# Altium schematic sheet microcontroller module.SchDoc: Microcontroller Module (MCM)
size A4; Date: 2014-12-21; Author: Artur Scholz; DocumentNumber: LibreCube LC23-01a
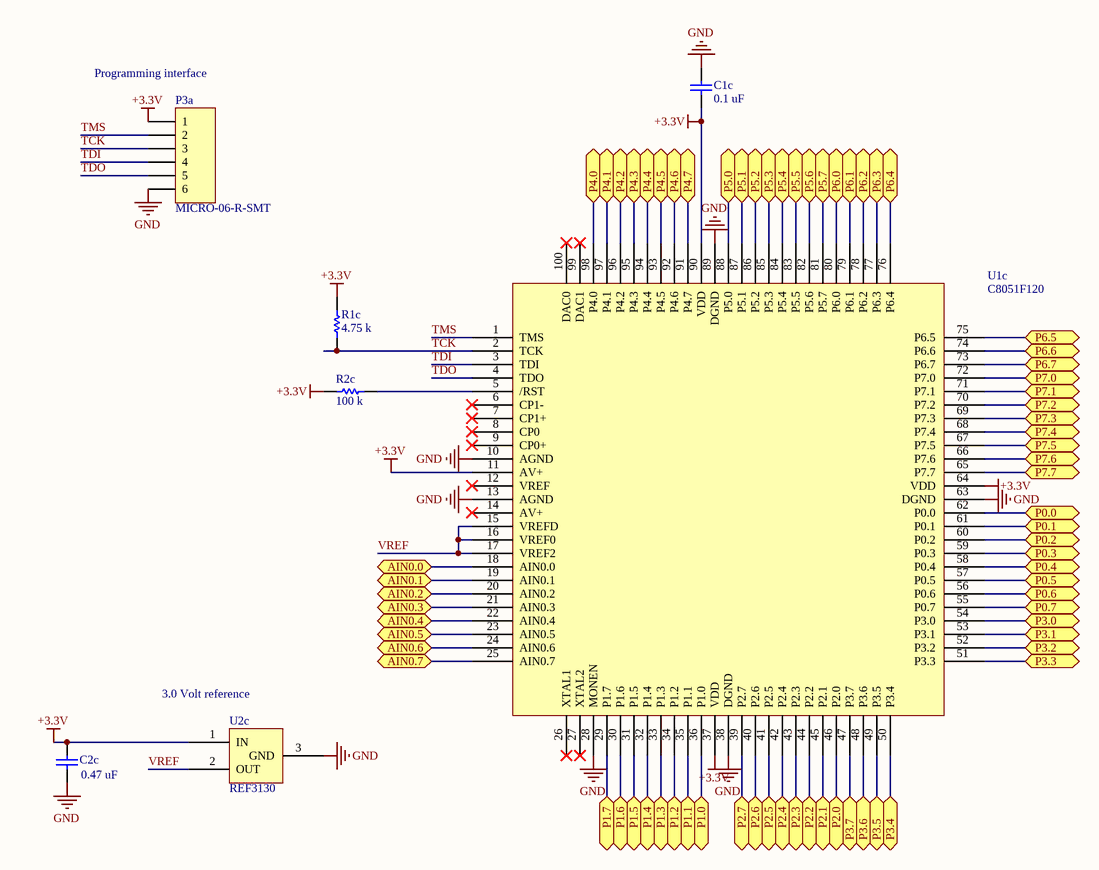
[diagram p0: microcontroller module.SchDoc]

## Parts
C1c  0.1 uF  [0603]
C2c  0.47 uF  [0603]
P3a  MICRO-06-R-SMT  [MICRO-06-R-SMT]
R1c  4.75 k  [0603]
R2c  100 k  [0603]
U1c  C8051F120  [TQFP-100]
U2c  REF3130  [SOT23-3]

## Ports
AIN0.0, AIN0.1, AIN0.2, AIN0.3, AIN0.4, AIN0.5, AIN0.6, AIN0.7, P0.0, P0.1, P0.2, P0.3, P0.4, P0.5, P0.6, P0.7, P1.0, P1.1, P1.2, P1.3, P1.4, P1.5, P1.6, P1.7, P2.0, P2.1, P2.2, P2.3, P2.4, P2.5, P2.6, P2.7, P3.0, P3.1, P3.2, P3.3, P3.4, P3.5, P3.6, P3.7, P4.0, P4.1, P4.2, P4.3, P4.4, P4.5, P4.6, P4.7, P5.0, P5.1, P5.2, P5.3, P5.4, P5.5, P5.6, P5.7, P6.0, P6.1, P6.2, P6.3, P6.4, P6.5, P6.6, P6.7, P7.0, P7.1, P7.2, P7.3, P7.4, P7.5, P7.6, P7.7

## Nets
+3.3V: C1c.2 C2c.1 P3a.1 R1c.2 R2c.2 U1c.11(AV+) U1c.37(VDD) U1c.64(VDD) U1c.90(VDD) U2c.1(IN)
GND: C1c.1 C2c.2 P3a.6 U1c.10(AGND) U1c.13(AGND) U1c.28(MONEN) U1c.38(DGND) U1c.63(DGND) U1c.89(DGND) U2c.3(GND)
AIN0.0: U1c.18(AIN0.0) ; port AIN0.0
AIN0.1: U1c.19(AIN0.1) ; port AIN0.1
AIN0.2: U1c.20(AIN0.2) ; port AIN0.2
AIN0.3: U1c.21(AIN0.3) ; port AIN0.3
AIN0.4: U1c.22(AIN0.4) ; port AIN0.4
AIN0.5: U1c.23(AIN0.5) ; port AIN0.5
AIN0.6: U1c.24(AIN0.6) ; port AIN0.6
AIN0.7: U1c.25(AIN0.7) ; port AIN0.7
P0.0: U1c.62(P0.0) ; port P0.0
P0.1: U1c.61(P0.1) ; port P0.1
P0.2: U1c.60(P0.2) ; port P0.2
P0.3: U1c.59(P0.3) ; port P0.3
P0.4: U1c.58(P0.4) ; port P0.4
P0.5: U1c.57(P0.5) ; port P0.5
P0.6: U1c.56(P0.6) ; port P0.6
P0.7: U1c.55(P0.7) ; port P0.7
P1.0: U1c.36(P1.0) ; port P1.0
P1.1: U1c.35(P1.1) ; port P1.1
P1.2: U1c.34(P1.2) ; port P1.2
P1.3: U1c.33(P1.3) ; port P1.3
P1.4: U1c.32(P1.4) ; port P1.4
P1.5: U1c.31(P1.5) ; port P1.5
P1.6: U1c.30(P1.6) ; port P1.6
P1.7: U1c.29(P1.7) ; port P1.7
P2.0: U1c.46(P2.0) ; port P2.0
P2.1: U1c.45(P2.1) ; port P2.1
P2.2: U1c.44(P2.2) ; port P2.2
P2.3: U1c.43(P2.3) ; port P2.3
P2.4: U1c.42(P2.4) ; port P2.4
P2.5: U1c.41(P2.5) ; port P2.5
P2.6: U1c.40(P2.6) ; port P2.6
P2.7: U1c.39(P2.7) ; port P2.7
P3.0: U1c.54(P3.0) ; port P3.0
P3.1: U1c.53(P3.1) ; port P3.1
P3.2: U1c.52(P3.2) ; port P3.2
P3.3: U1c.51(P3.3) ; port P3.3
P3.4: U1c.50(P3.4) ; port P3.4
P3.5: U1c.49(P3.5) ; port P3.5
P3.6: U1c.48(P3.6) ; port P3.6
P3.7: U1c.47(P3.7) ; port P3.7
P4.0: U1c.98(P4.0) ; port P4.0
P4.1: U1c.97(P4.1) ; port P4.1
P4.2: U1c.96(P4.2) ; port P4.2
P4.3: U1c.95(P4.3) ; port P4.3
P4.4: U1c.94(P4.4) ; port P4.4
P4.5: U1c.93(P4.5) ; port P4.5
P4.6: U1c.92(P4.6) ; port P4.6
P4.7: U1c.91(P4.7) ; port P4.7
P5.0: U1c.88(P5.0) ; port P5.0
P5.1: U1c.87(P5.1) ; port P5.1
P5.2: U1c.86(P5.2) ; port P5.2
P5.3: U1c.85(P5.3) ; port P5.3
P5.4: U1c.84(P5.4) ; port P5.4
P5.5: U1c.83(P5.5) ; port P5.5
P5.6: U1c.82(P5.6) ; port P5.6
P5.7: U1c.81(P5.7) ; port P5.7
P6.0: U1c.80(P6.0) ; port P6.0
P6.1: U1c.79(P6.1) ; port P6.1
P6.2: U1c.78(P6.2) ; port P6.2
P6.3: U1c.77(P6.3) ; port P6.3
P6.4: U1c.76(P6.4) ; port P6.4
P6.5: U1c.75(P6.5) ; port P6.5
P6.6: U1c.74(P6.6) ; port P6.6
P6.7: U1c.73(P6.7) ; port P6.7
P7.0: U1c.72(P7.0) ; port P7.0
P7.1: U1c.71(P7.1) ; port P7.1
P7.2: U1c.70(P7.2) ; port P7.2
P7.3: U1c.69(P7.3) ; port P7.3
P7.4: U1c.68(P7.4) ; port P7.4
P7.5: U1c.67(P7.5) ; port P7.5
P7.6: U1c.66(P7.6) ; port P7.6
P7.7: U1c.65(P7.7) ; port P7.7
TCK: P3a.3 R1c.1 U1c.2(TCK)
TDI: P3a.4 U1c.3(TDI)
TDO: P3a.5 U1c.4(TDO)
TMS: P3a.2 U1c.1(TMS)
VREF: U1c.15(VREFD) U1c.16(VREF0) U1c.17(VREF2) U2c.2(OUT)
NetR2c_1: R2c.1 U1c.5(/RST)

Not connected (* = marked no-connect by the designer): U1c 6(CP1-)* 7(CP1+)* 8(CP0)* 9(CP0+)* 12(VREF)* 14(AV+)* 26(XTAL1)* 27(XTAL2)* 99(DAC1)* 100(DAC0)*

## Notes on the sheet
- (near P3a) Programming interface
- (near U2c) 3.0 Volt reference

## Library data of the parts
C1c C2c = Cap
  C2c: Published: 8-Jun-2000; Revision: July-2002: Re-released for DXP Platform.; Publisher: Altium Limited
P3a = MICRO-06: Micro Connector
R1c R2c = Res
U1c = C8051F120: Microcontroller
U2c = REF3130: 296-17098-1-ND